# Altium schematic sheet 1.27mm 5P2.schdoc
size 51 x 40 mm
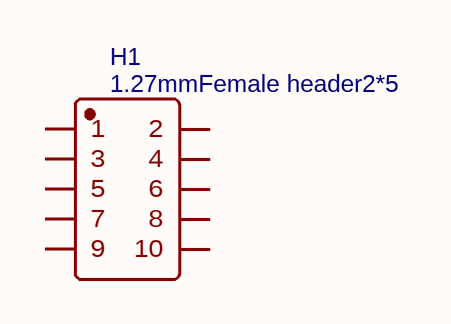
[diagram p0: 1.27mm 5P2.schdoc]

## Parts
H1  1.27mmFemale header2*5  [HDR-SMD_10P-P1.27-V-R2-C5-S5.00]

## Nets

Not connected (* = marked no-connect by the designer): H1 1 2 3 4 5 6 7 8 9 10

## Library data of the parts
H1 = 1.27mmFemale header2*5: BOM_Manufacturer: BOOMELE; BOM_Supplier: LCSC; BOM_Manufacturer Part: 1.27mmFemale header2*5; image: //image.lceda.cn/szlcsc/C59983.jpg; BOM_Supplier Part: C59983; spicePre: H; spiceSymbolName: 1.27mmFemale header2*5